# EAGLE design motherboard (EAGLE 9.0.1)
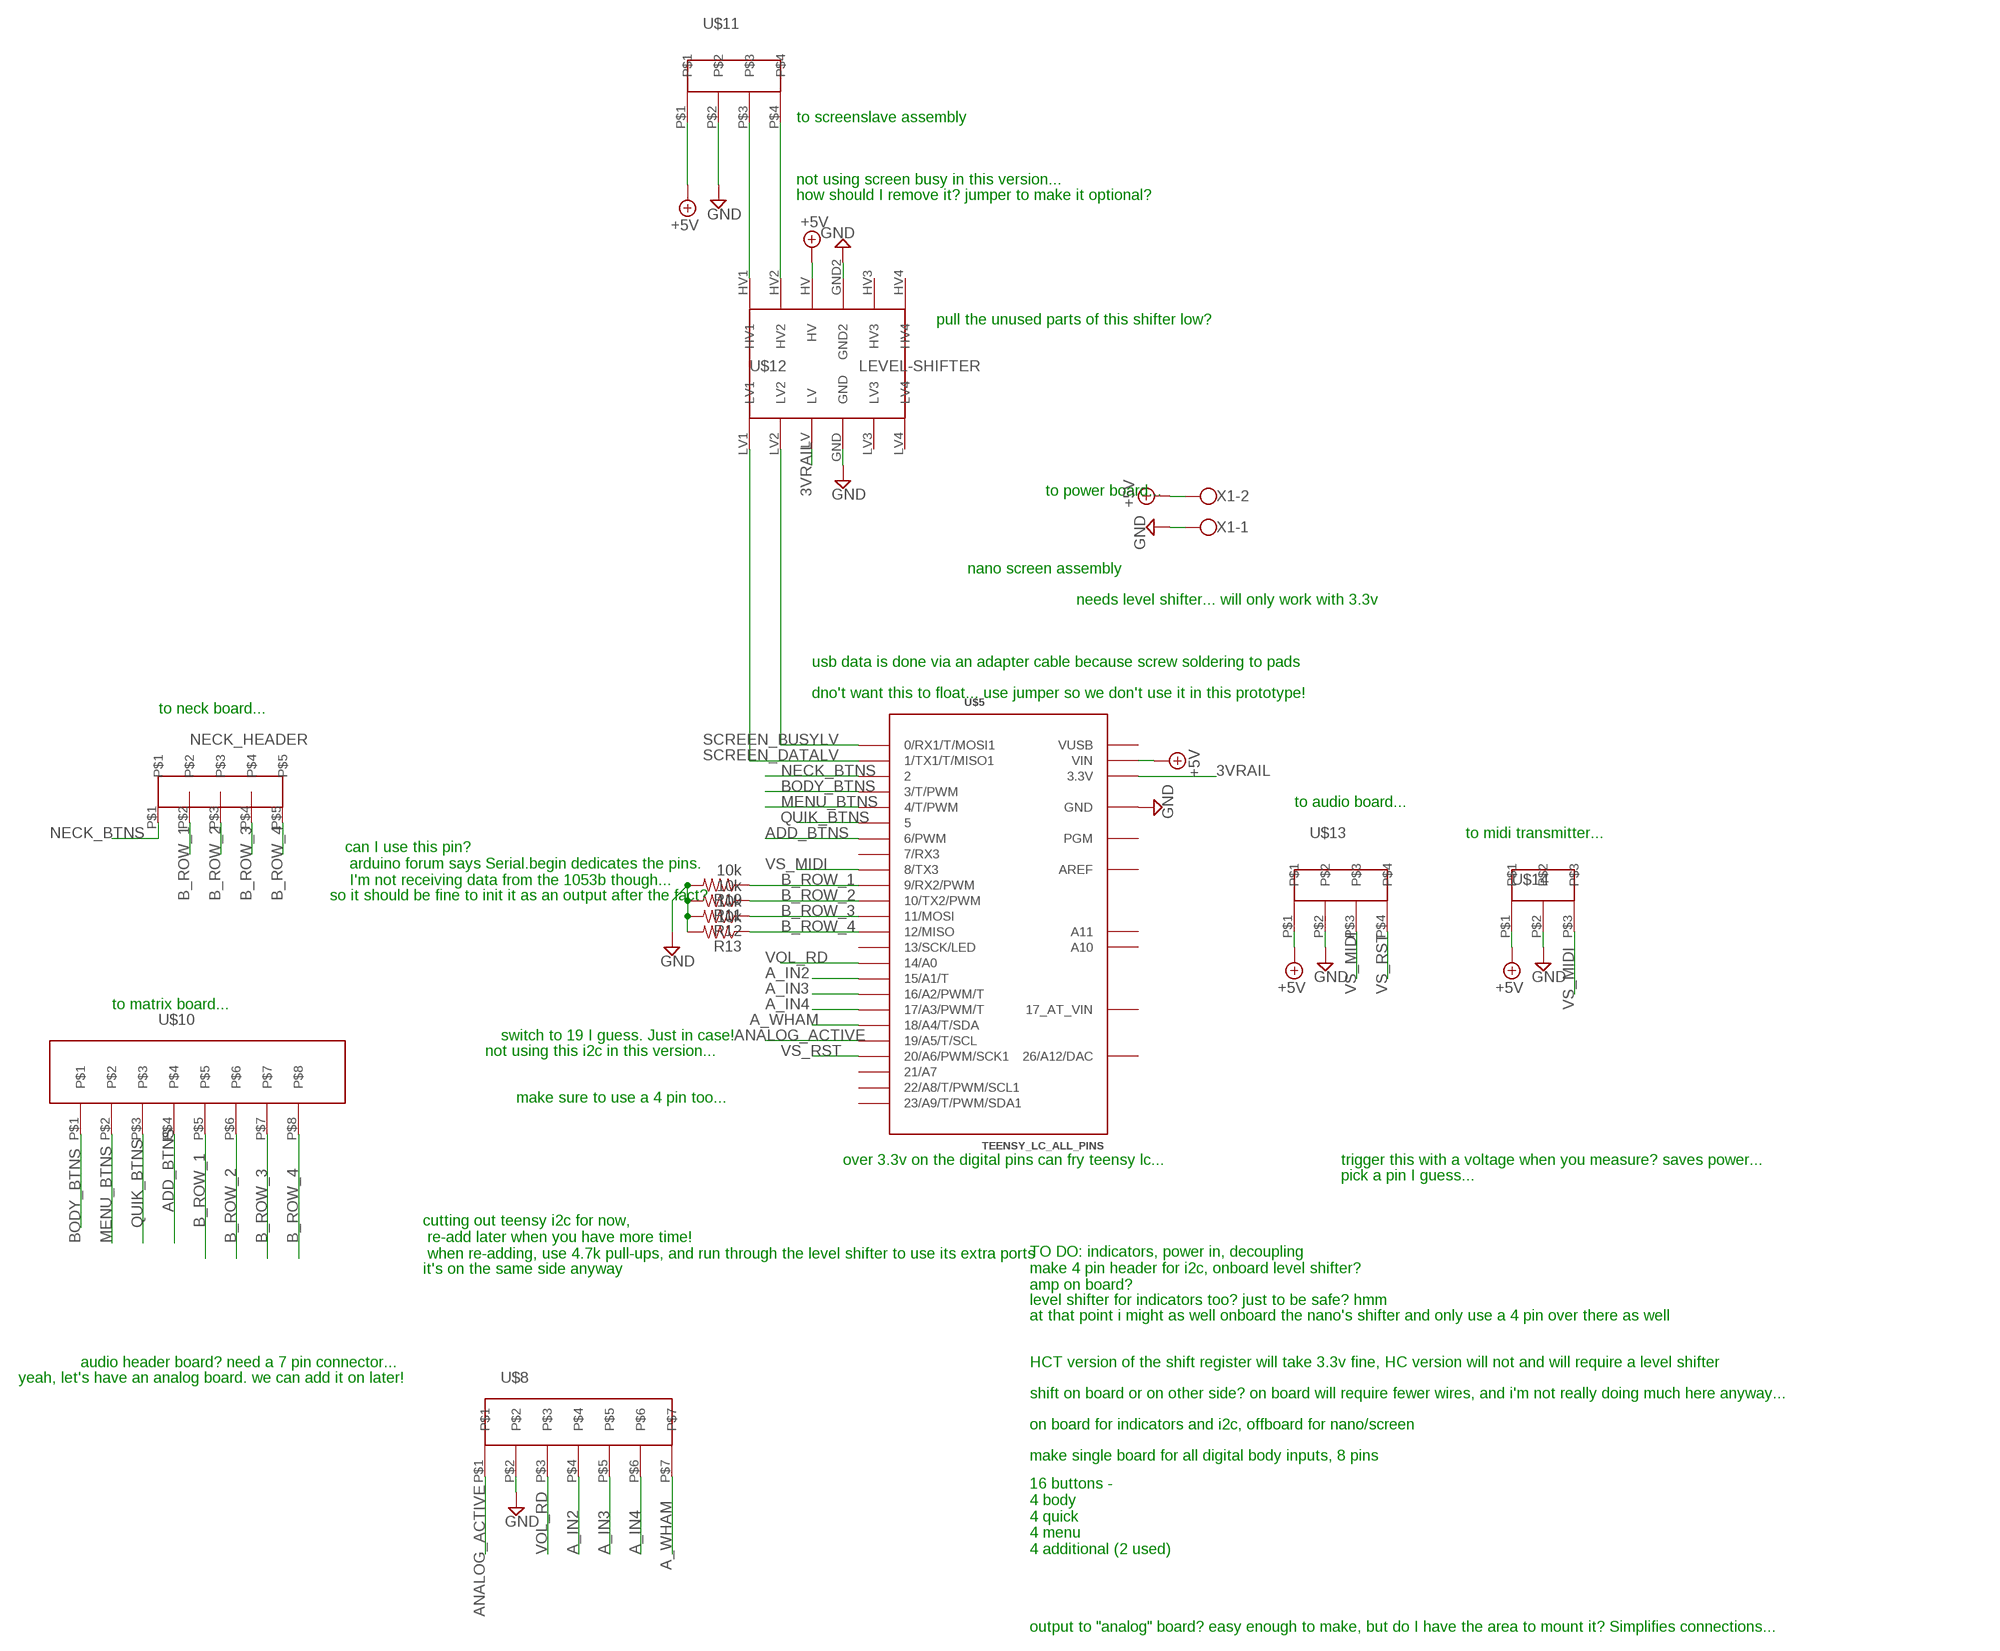
[diagram p0: schematic, sheet 1]

## Parts
NECK_HEADER  5-PIN-HEADER  [5-PIN-HEADER]
R10  10k  R-US_0204/7  [0204/7]
R11  10k  R-US_0204/7  [0204/7]
R12  10k  R-US_0204/7  [0204/7]
R13  10k  R-US_0204/7  [0204/7]
U$5  TEENSY_LC_ALL_PINS  [TEENSY_3.0-3.2&LC_ALL_PINS]
U$8  7-PIN-HEADER  [7-PIN-HEADER]
U$10  8-PIN-HEADER  [8-PIN-HEADER]
U$11  4-PIN-HEADER  [4-PIN-HEADER]
U$12  LEVEL-SHIFTER  [LEVEL-SHIFTER]
U$13  4-PIN-HEADER  [4-PIN-HEADER]
U$14  3-PIN-HEADER  [3-PIN-HEADER]
X1  W237-102  [W237-102]

## Nets
3VRAIL: U$5.3.3V U$5.3.3V1(3.3V) U$12.LV
+5V: U$5.VIN U$11.P$1 U$12.HV U$13.P$1 U$14.P$1 X1.2
A_IN2: U$5.15/A1(15/A1/T) U$8.P$4
A_IN3: U$5.16/A2(16/A2/PWM/T) U$8.P$5
A_IN4: U$5.17/A3(17/A3/PWM/T) U$8.P$6
A_WHAM: U$5.18/A4(18/A4/T/SDA) U$8.P$7
ADD_BTNS: U$5.6(6/PWM) U$10.P$4
ANALOG_ACTIVE: U$5.19/A5(19/A5/T/SCL) U$8.P$1
B_ROW_1: NECK_HEADER.P$2 R10.1 U$5.9(9/RX2/PWM) U$10.P$5
B_ROW_2: NECK_HEADER.P$3 R11.1 U$5.10(10/TX2/PWM) U$10.P$6
B_ROW_3: NECK_HEADER.P$4 R12.1 U$5.11(11/MOSI) U$10.P$7
B_ROW_4: NECK_HEADER.P$5 R13.1 U$5.12(12/MISO) U$10.P$8
BODY_BTNS: U$5.3(3/T/PWM) U$10.P$1
GND: R10.2 R11.2 R12.2 R13.2 U$5.AGND(GND) U$5.GND U$5.GND1(GND) U$8.P$2 U$11.P$2 U$12.GND U$12.GND2 U$13.P$2 U$14.P$2 X1.1
MENU_BTNS: U$5.4(4/T/PWM) U$10.P$2
N$4: U$11.P$3 U$12.HV1
N$5: U$11.P$4 U$12.HV2
NECK_BTNS: NECK_HEADER.P$1 U$5.2
QUIK_BTNS: U$5.5 U$10.P$3
SCREEN_BUSYLV: U$5.0(0/RX1/T/MOSI1) U$12.LV2
SCREEN_DATALV: U$5.1(1/TX1/T/MISO1) U$12.LV1
VOL_RD: U$5.14/A0 U$8.P$3
VS_MIDI: U$5.8(8/TX3) U$13.P$3 U$14.P$3
VS_RST: U$5.20/A6(20/A6/PWM/SCK1) U$13.P$4
Unconnected: U$5.7(7/RX3) U$5.13(13/SCK/LED) U$5.21/A7 U$5.22/A8(22/A8/T/PWM/SCL1) U$5.23/A9(23/A9/T/PWM/SDA1) U$5.A10 U$5.A11 U$5.PGM U$5.VBAT(17_AT_VIN) U$12.HV3 U$12.HV4 U$12.LV3 U$12.LV4

## Notes on the sheet
- to screenslave assembly
- not using screen busy in this version...
- how should I remove it? jumper to make it optional?
- pull the unused parts of this shifter low?
- to power board...
- nano screen assembly
- needs level shifter... will only work with 3.3v
- usb data is done via an adapter cable because screw soldering to pads
- dno't want this to float... use jumper so we don't use it in this prototype!
- to neck board...
- to audio board...
- to midi transmitter...
- can I use this pin?
   arduino forum says Serial.begin dedicates the pins.
   I'm not receiving data from the 1053b though...
- so it should be fine to init it as an output after the fact?
- to matrix board...
- switch to 19 I guess. Just in case!
- not using this i2c in this version...
- make sure to use a 4 pin too...
- over 3.3v on the digital pins can fry teensy lc... | trigger this with a voltage when you measure? saves power...
- pick a pin I guess...
- cutting out teensy i2c for now,
   re-add later when you have more time!
   when re-adding, use 4.7k pull-ups, and run through the level shifter to use its extra ports
- it's on the same side anyway
- TO DO: indicators, power in, decoupling
  make 4 pin header for i2c, onboard level shifter?
  amp on board?
- level shifter for indicators too? just to be safe? hmm
- at that point i might as well onboard the nano's shifter and only use a 4 pin over there as well
- audio header board? need a 7 pin connector... | HCT version of the shift register will take 3.3v fine, HC version will not and will require a level shifter
- yeah, let's have an analog board. we can add it on later!
- shift on board or on other side? on board will require fewer wires, and i'm not really doing much here anyway...
- on board for indicators and i2c, offboard for nano/screen
- make single board for all digital body inputs, 8 pins
- 16 buttons - 
  4 body 
  4 quick
  4 menu
  4 additional (2 used)
- output to "analog" board? easy enough to make, but do I have the area to mount it? Simplifies connections...

## Power pins joined to a net without a drawn wire
26/A12/DAC: U$5.RESET/DAC(26/A12/DAC)
AREF: U$5.AREF
VUSB: U$5.VUSB

## Library data of the parts
NECK_HEADER = mask_lbr:5-PIN-HEADER
R10-R13 = rcl:R-US_: RESISTOR, American symbol; SPICEPREFIX: R
U$5 = Teensy_3_and_LC_Series_Boards_v1.4:TEENSY_LC_ALL_PINS: Teensy LC board with all pins used.
U$8 = mask_lbr:7-PIN-HEADER
U$10 = mask_lbr:8-PIN-HEADER
U$11 U$13 = mask_lbr:4-PIN-HEADER
U$12 = mask_lbr:LEVEL-SHIFTER
U$14 = mask_lbr:3-PIN-HEADER
X1 = mask_lbr:W237-102: WAGO SCREW CLAMP; MPN: 237-102; OC_FARNELL: unknown; OC_NEWARK: 70K9898

## Net classes
0 default: width 0.508 mm, clearance 0.254 mm

## Board
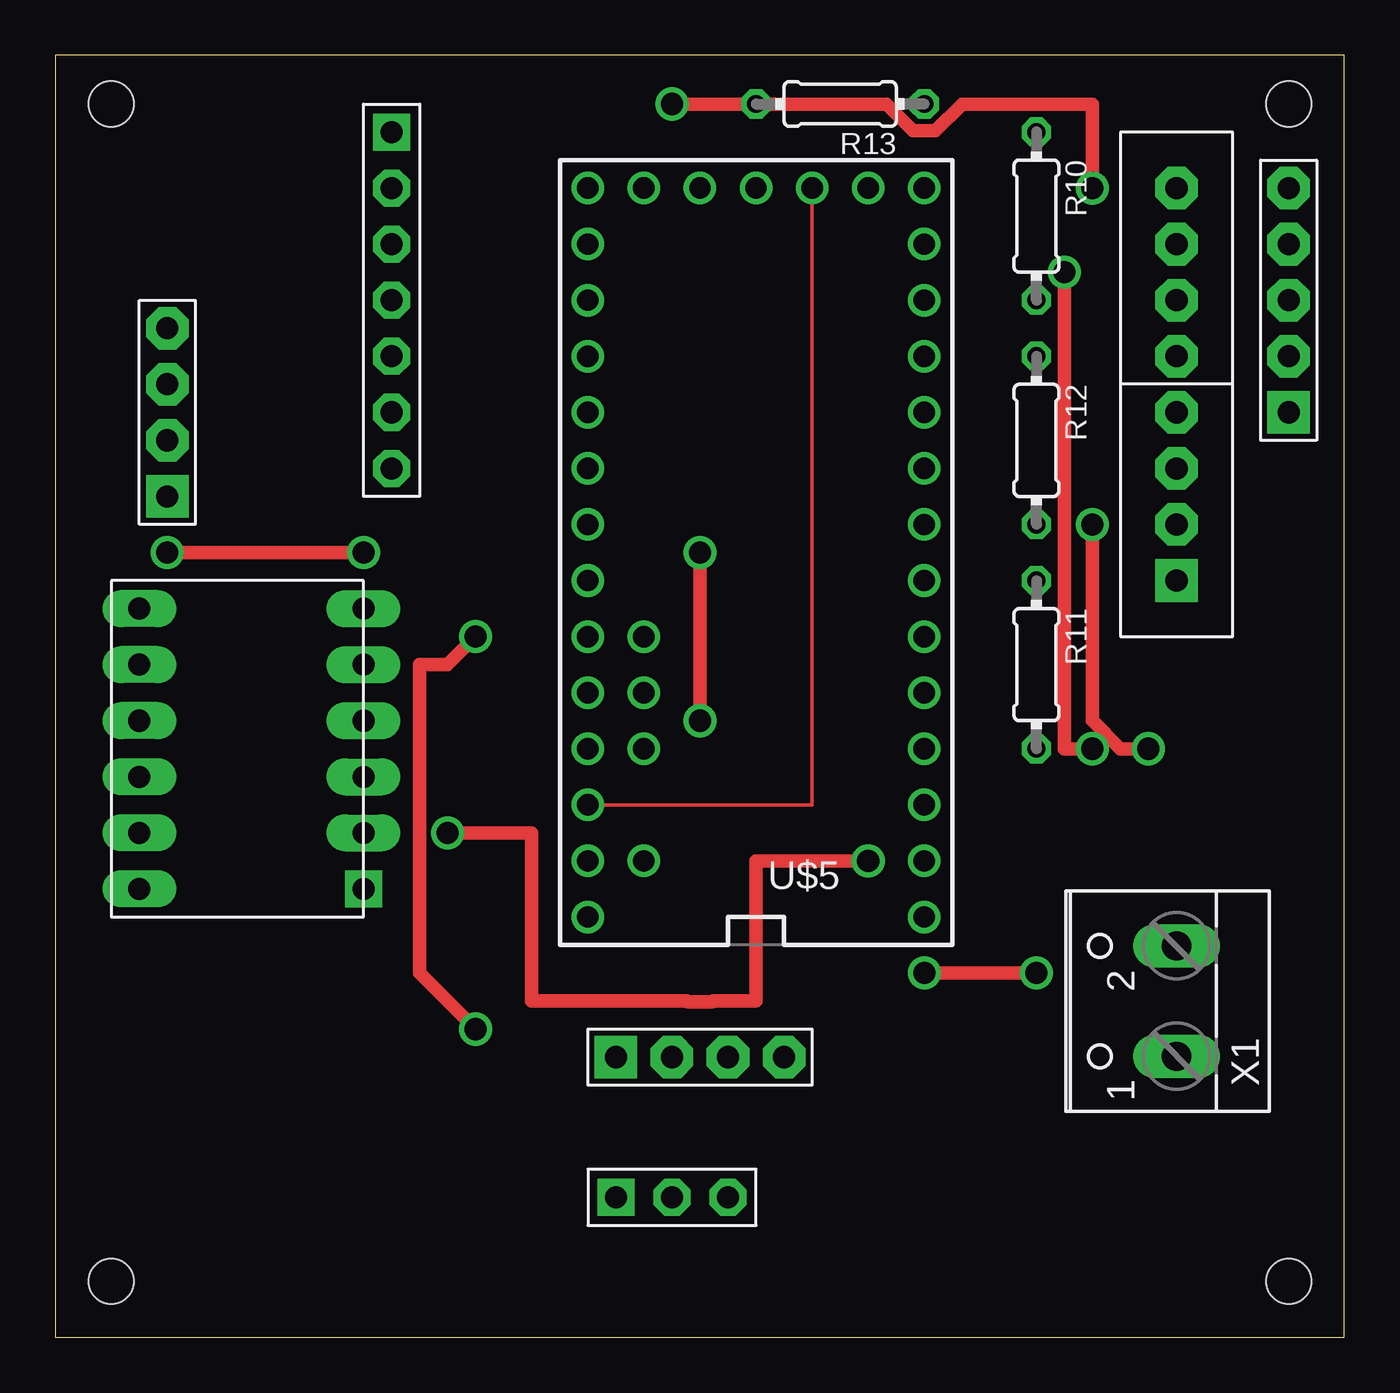
[diagram p1: board, top side]
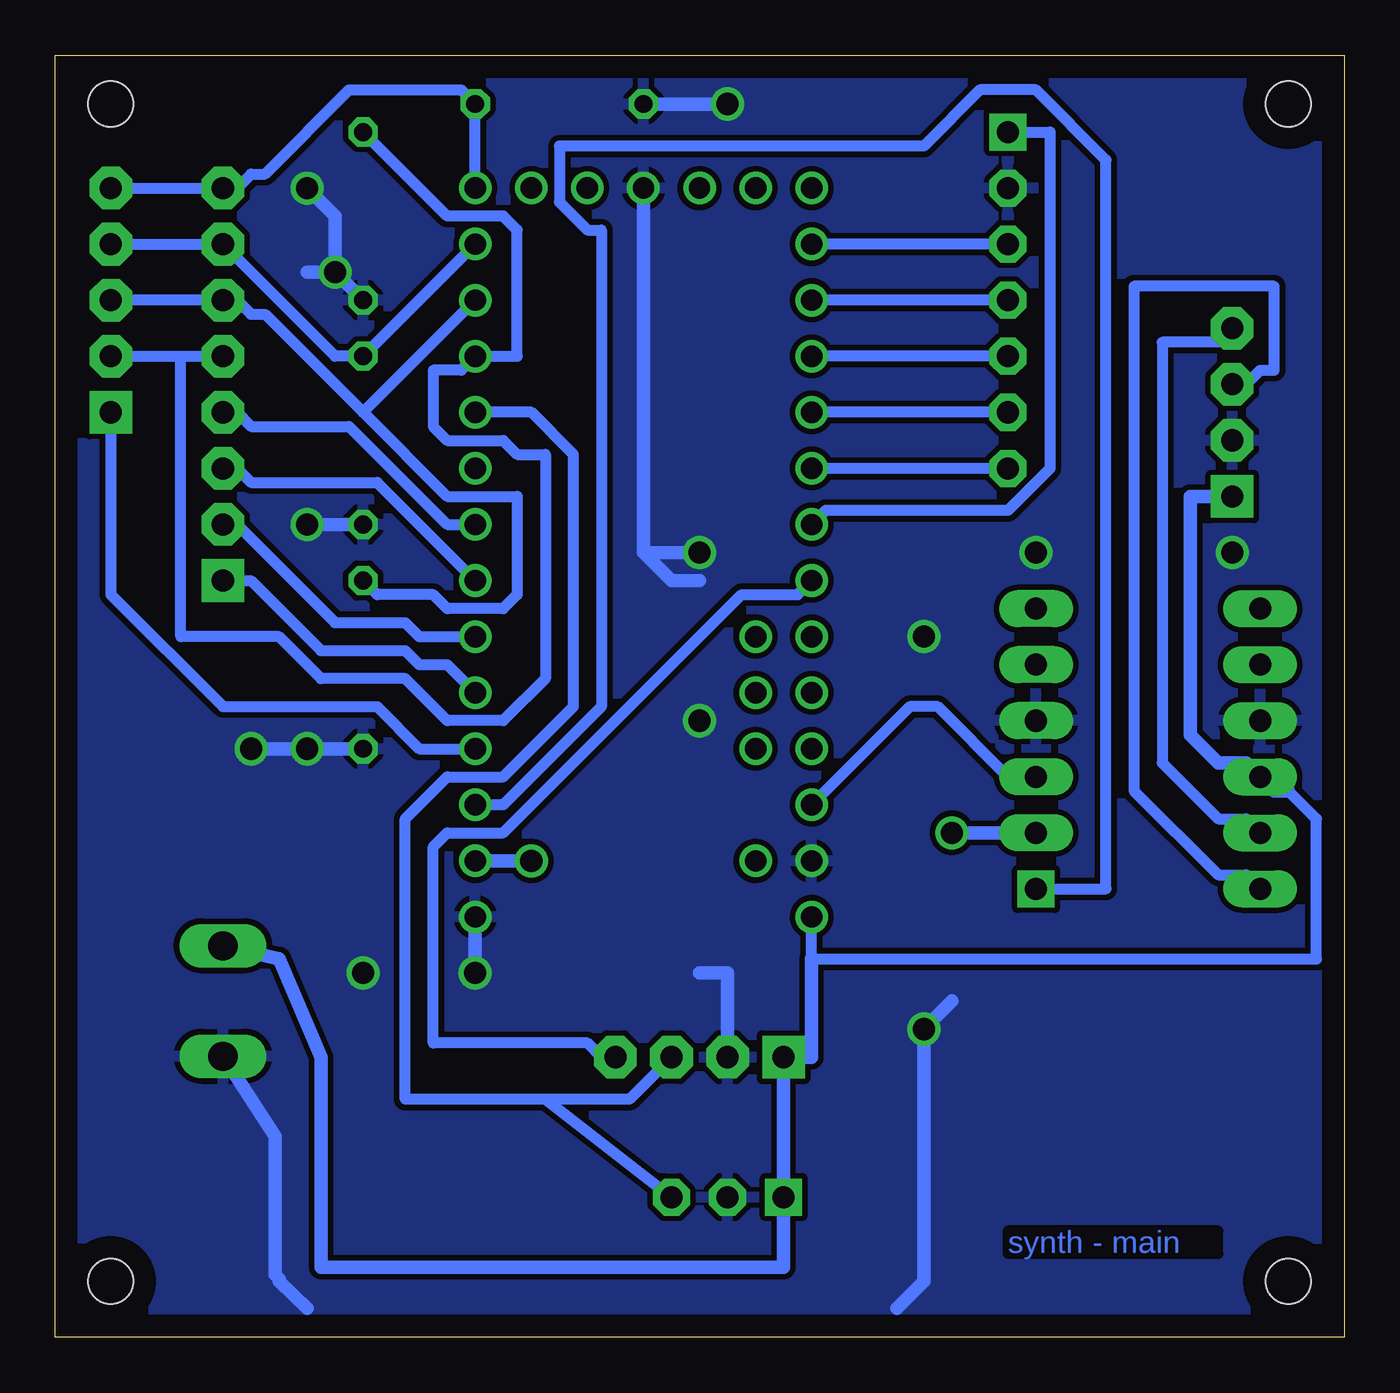
[diagram p2: board, bottom side, seen from below]

Size 58.4 x 58.09 mm. Coordinates in mm from the lower left corner, seen from the top.
Outline: 0,0 58.4,0 58.4,58.09 0,58.09 0,0
Copper layers (1*16): Top 0.035mm / dielectric 1.5mm / Bottom 0.035mm
Design rules "default": minimum track width 6mil, minimum drill 0.35mm, track to track 6mil, track to pad 6mil, pad to pad 6mil, via to via 6mil, smd to smd 6mil, copper to edge 40mil, drill to drill 6mil, minimum pad ring 10mil, minimum via ring 8mil, stop-mask expansion 4mil, vias tented up to drill 0mil, thermal gap 10mil
Holes 2.03 mm at 2.54,2.54 55.88,2.54 55.88,55.88 2.54,55.88

### Footprints (pad centres in the part's own frame; a part is rotated, then mirrored left to right if it is on the bottom)
5-PIN-HEADER = drill 1 pad 1.93 square: P$1 -5.08,0 | drill 1 pad 1.93 octagon: P$2 -2.54,0; P$3 0,0; P$4 2.54,0; P$5 5.08,0
0204/7 = drill 0.813 octagon: 1 -3.81,0; 2 3.81,0
TEENSY_3.0-3.2&LC_ALL_PINS = drill 0.965: 0 -7.62,13.97; 1 -7.62,11.43; 2 -7.62,8.89; 3 -7.62,6.35; 3.3V 7.62,11.43; 3.3V1 -2.54,-16.51; 4 -7.62,3.81; 5 -7.62,1.27; 6 -7.62,-1.27; 7 -7.62,-3.81; 8 -7.62,-6.35; 9 -7.62,-8.89; 10 -7.62,-11.43; 11 -7.62,-13.97; 12 -7.62,-16.51; 13 7.62,-16.51; 14/A0 7.62,-13.97; 15/A1 7.62,-11.43; 16/A2 7.62,-8.89; 17/A3 7.62,-6.35; 18/A4 7.62,-3.81; 19/A5 7.62,-1.27; 20/A6 7.62,1.27; 21/A7 7.62,3.81; 22/A8 7.62,6.35; 23/A9 7.62,8.89; A10 5.08,6.35; A11 5.08,3.81; AGND 7.62,13.97; AREF 5.08,8.89; GND -7.62,16.51; GND1 0,-16.51; PGM 2.54,-16.51; RESET/DAC 5.08,-16.51; VBAT -5.08,-16.51; VIN 7.62,16.51; VUSB 5.08,13.97
7-PIN-HEADER = drill 1 pad 1.676 square: P$1 -7.62,0 | drill 1 pad 1.676 octagon: P$2 -5.08,0; P$3 -2.54,0; P$4 0,0; P$5 2.54,0; P$6 5.08,0; P$7 7.62,0
8-PIN-HEADER = drill 1 pad 1.93 square: P$1 -8.89,0 | drill 1 pad 1.93 octagon: P$2 -6.35,0; P$3 -3.81,0; P$4 -1.27,0; P$5 1.27,0; P$6 3.81,0; P$7 6.35,0; P$8 8.89,0
4-PIN-HEADER = drill 1 pad 1.93 square: P$1 -3.81,0 | drill 1 pad 1.93 octagon: P$2 -1.27,0; P$3 1.27,0; P$4 3.81,0
LEVEL-SHIFTER = drill 1 pad 1.676 long: GND 1.27,-5.08; GND2 1.27,5.08; HV -1.27,5.08; HV1 -6.35,5.08; HV2 -3.81,5.08; HV3 3.81,5.08; HV4 6.35,5.08; LV -1.27,-5.08; LV2 -3.81,-5.08; LV3 3.81,-5.08; LV4 6.35,-5.08 | drill 1 pad 1.676 square: LV1 -6.35,-5.08
3-PIN-HEADER = drill 1 pad 1.676 square: P$1 -2.54,0 | drill 1 pad 1.676 octagon: P$2 0,0; P$3 2.54,0
W237-102 = drill 1.321 long: 1 -2.5,-1.27; 2 2.5,-1.27

### Placement (x,y rotation side)
NECK_HEADER  55.88,46.99 90 top
R10  44.45,50.8 270 top
R11  44.45,30.48 270 top
R12  44.45,40.64 270 top
R13  35.56,55.88 180 top
U$5  31.75,35.56 180 top
U$8  15.24,46.99 270 top
U$10  50.8,43.18 90 top
U$11  5.08,41.91 90 top
U$12  8.89,26.67 90 top
U$13  29.21,12.7 0 top
U$14  27.94,6.35 0 top
X1  49.53,15.24 90 top

### Tracks (layer width: path | path; a pad name or v marks a point on that pad's centre or on a via)
3VRAIL
  Top 0.152: U$5.3.3V 34.29,24.13 U$5.3.3V1
  Bottom 0.508: U$5.3.3V 19.68,28.57 18.41,28.57 15.24,25.4 U$12.LV
+5V
  Bottom 0.508: 4.45,26.04 U$12.HV | U$5.VIN 24.13,17.14 1.27,17.14 1.27,23.5 2.54,24.77
  Bottom 0.61: 4.45,26.04 5.71,26.04 6.99,27.3 6.99,38.1 U$11.P$1 | 24.13,17.14 24.13,12.7 U$13.P$1 U$14.P$1 25.4,3.18 46.35,3.18 46.35,12.7 48.26,17.14 X1.2 | U$12.HV 3.17,24.77 2.54,24.77
A_IN2
  Bottom 0.508: U$8.P$4 U$5.15/A1
A_IN3
  Bottom 0.508: U$8.P$5 U$5.16/A2
A_IN4
  Bottom 0.508: U$8.P$6 U$5.17/A3
A_WHAM
  Bottom 0.508: U$8.P$7 U$5.18/A4
ADD_BTNS
  Bottom 0.508: U$5.6 40.64,36.83 45.09,41.27 49.53,41.27 50.16,41.91 U$10.P$4
ANALOG_ACTIVE
  Bottom 0.508: U$5.19/A5 23.5,37.46 15.24,37.46 13.34,39.37 13.34,54.61 U$8.P$1
B_ROW_1
  Bottom 0.508: NECK_HEADER.P$2 52.7,44.45 | 52.7,44.45 U$10.P$5 | R10.1 40.64,50.8 38.1,50.8 37.47,50.16 37.47,44.45 U$5.9 40.01,43.81 41.27,43.81 41.27,41.27 40.64,40.64 38.1,40.64 37.47,40 36.2,40 36.2,29.85 38.1,27.94 40.64,27.94 42.55,29.85 46.35,29.85 48.26,31.75 52.7,31.75 52.7,44.45
B_ROW_2
  Bottom 0.508: R11.1 43.81,33.66 41.27,33.66 40.64,33.02 38.1,33.02 37.47,33.66 37.47,38.1 40.64,38.1 44.45,41.91 | 44.45,41.91 48.9,46.35 49.53,46.35 50.16,46.99 U$10.P$6 NECK_HEADER.P$3 | 44.45,41.91 U$5.10
B_ROW_3
  Bottom 0.508: NECK_HEADER.P$4 U$10.P$7 45.72,44.45 R12.1 U$5.11
B_ROW_4
  Bottom 0.508: U$5.12 R13.1 40.01,56.52 45.09,56.52 48.9,52.7 49.53,52.7 50.16,52.07 U$10.P$8 NECK_HEADER.P$5
BODY_BTNS
  Bottom 0.508: U$5.3 40.64,30.48 41.91,30.48 42.55,31.11 46.35,31.11 49.53,34.29 U$10.P$1
GND  (via drill 1 pad 1.1)
  Top 0.61: v19.05,13.97 16.51,16.51 16.51,30.48 17.78,30.48 v19.05,31.75 | v39.37,16.51 v44.45,16.51 | v45.72,48.26 45.72,26.67 v46.99,26.67 | v46.99,36.83 46.99,27.94 48.26,26.67 v49.53,26.67 | v29.21,35.56 v29.21,27.94 | v27.94,55.88 37.65,55.88 38.87,54.66 39.88,54.66 41.09,55.88 46.99,55.88 v46.99,52.07 | v5.08,35.56 v13.97,35.56
  Bottom 0.61: U$13.P$2 27.94,16.51 29.21,16.51 | X1.1 48.44,9.11 48.44,2.84 48.26,2.66 48.26,2.54 46.99,1.32 | 17.78,15.24 v19.05,13.97 19.05,2.54 20.27,1.32 | R13.2 v27.94,55.88 | U$5.GND v39.37,16.51 | R10.2 v45.72,48.26 | v45.72,48.26 46.99,48.26 | R12.2 v46.99,36.83 | v46.99,26.67 R11.2 v49.53,26.67 | U$5.GND1 31.75,35.56 | 31.75,35.56 30.48,34.29 29.21,34.29 | 31.75,35.56 v29.21,35.56 | v46.99,52.07 45.72,50.8 v45.72,48.26
  pour Bottom: 58.42,0 0,0 0,58.42 58.42,58.42
MENU_BTNS
  Bottom 0.508: U$5.4 41.91,31.75 42.55,32.38 45.72,32.38 50.16,36.83 U$10.P$2
N$4
  Bottom 0.508: U$12.HV1 4.45,20.96 5.71,20.96 9.53,24.77 9.53,47.62 3.17,47.62 3.17,43.81 3.81,43.81 4.45,43.18 U$11.P$3
N$5
  Bottom 0.508: U$12.HV2 4.45,23.5 5.71,23.5 8.26,26.04 8.26,45.09 5.08,45.09 4.45,45.72 U$11.P$4
NECK_BTNS
  Bottom 0.508: U$5.2 41.91,26.67 43.81,28.57 50.8,28.57 55.88,33.66 NECK_HEADER.P$1
QUIK_BTNS
  Bottom 0.508: U$5.5 43.81,38.73 49.53,38.73 50.16,39.37 U$10.P$3
SCREEN_BUSYLV  (via drill 1 pad 1.1)
  Top 0.61: v36.83,21.59 31.75,21.59 31.75,15.24 29.79,15.24 29.75,15.2 28.67,15.2 28.63,15.24 21.59,15.24 21.59,22.86 v17.78,22.86
  Bottom 0.61: U$5.0 v36.83,21.59 | v17.78,22.86 U$12.LV2
SCREEN_DATALV
  Bottom 0.508: U$5.1 38.1,24.13 33.66,28.57 33.66,50.16 34.29,50.16 35.56,51.43 35.56,53.97 19.05,53.97 16.51,56.52 13.97,56.52 10.79,53.34 10.79,20.32 U$12.LV1
VOL_RD
  Bottom 0.508: U$8.P$3 U$5.14/A0
VS_MIDI
  Bottom 0.508: U$5.8 36.83,41.91 34.92,40 34.92,28.57 38.1,25.4 40.64,25.4 42.55,23.5 42.55,10.79 36.2,10.79 | 36.2,10.79 32.38,10.79 U$13.P$3 | 36.2,10.79 U$14.P$3
VS_RST
  Bottom 0.508: U$5.20/A6 24.77,33.66 27.3,33.66 38.1,22.86 40.64,22.86 41.27,22.23 41.27,13.33 34.29,13.33 33.66,12.7 U$13.P$4

### Text on the board
Bottom: synth - main
Document: to analog board | to screen assembly | to neck board | to matrix board | busy jumper | todo: / thicker grounds / replace teensy part with one without the internal pins / might be able to get away without edge pins even | maybe rearrange these parts, especially the screen out | take out screen busy maybe? not being used in this software anymore | jumper wire instead of header | should be fine for prototype though | to audio board | to midi transmitter